# EAGLE design WeatherStation (EAGLE 9.6.2)
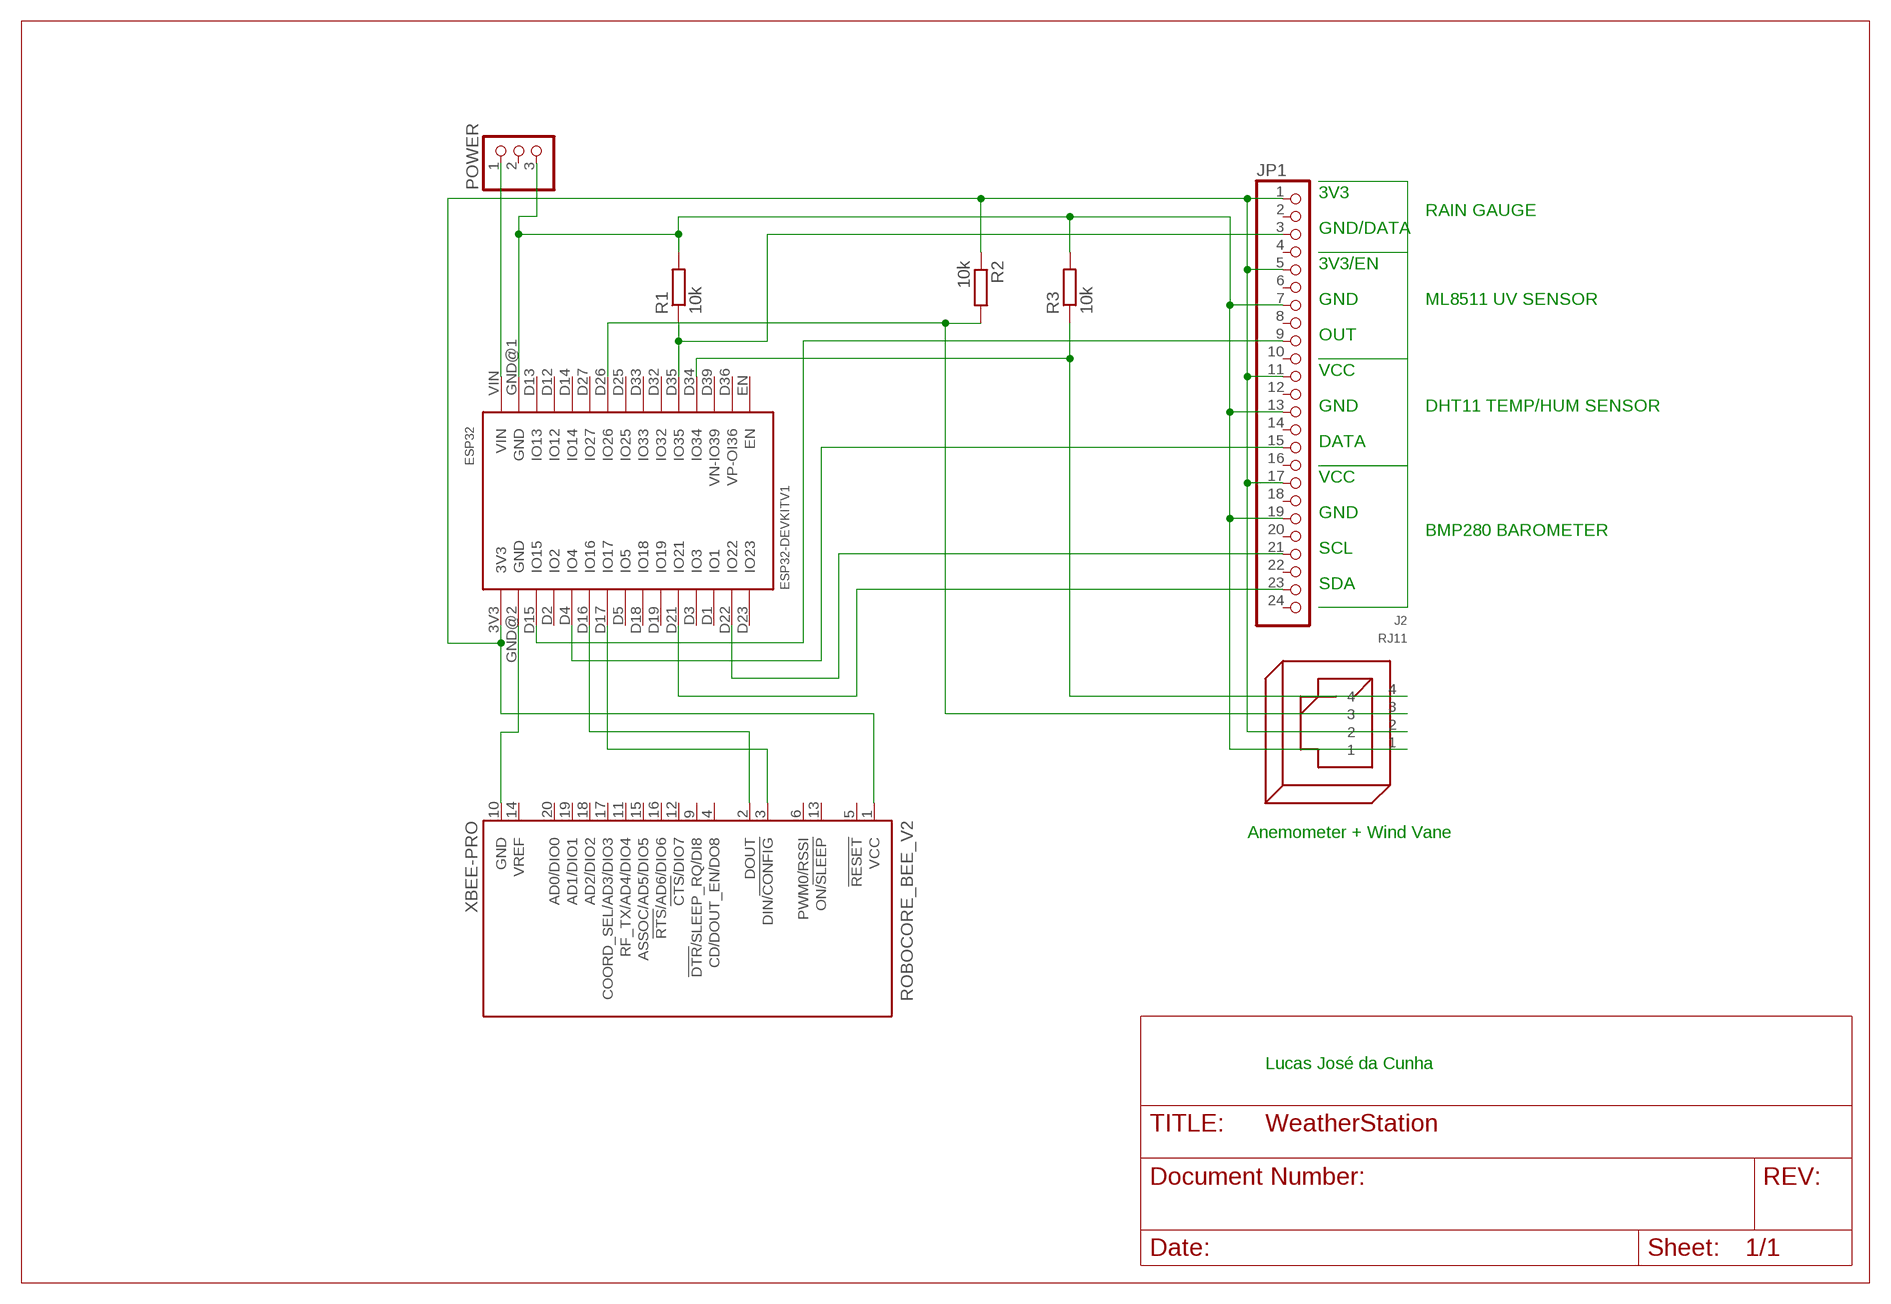
[diagram p0: schematic, sheet 1]

## Parts
ESP32  ESP32DEVKITV1  [ESP32-DEVKITV1]
J2  RJ11  [RJ11]
JP1  PINHD-1X24  [1X24]
POWER  PINHD-1X3  [1X03]
R1  10k  R-EU_0204/7  [0204/7]
R2  10k  R-EU_0204/7  [0204/7]
R3  10k  R-EU_0204/7  [0204/7]
ROBOCORE_BEE_V2  XBEE-PRO  [XBEE-PRO]

## Nets
N$1: ESP32.3V3 J2.2 JP1.1 JP1.5 JP1.11 JP1.17 R2.1 ROBOCORE_BEE_V2.1(VCC)
N$2: ESP32.D26(IO26) J2.3 R2.2
N$3: ESP32.D35(IO35) JP1.3 R1.1
N$4: ESP32.D15(IO15) JP1.9
N$5: ESP32.D16(IO16) ROBOCORE_BEE_V2.2(DOUT)
N$6: ESP32.GND@2(GND) ROBOCORE_BEE_V2.10(GND)
N$7: ESP32.D4(IO4) JP1.15
N$8: ESP32.VIN POWER.1
N$9: ESP32.D22(IO22) JP1.21
N$10: ESP32.D21(IO21) JP1.23
N$11: ESP32.D17(IO17) ROBOCORE_BEE_V2.3(DIN/!CONFIG)
N$13: ESP32.GND@1(GND) J2.1 JP1.7 JP1.13 JP1.19 POWER.3 R1.2 R3.2
N$16: ESP32.D34(IO34) J2.4 R3.1
Unconnected: ESP32.D1(IO1) ESP32.D2(IO2) ESP32.D3(IO3) ESP32.D5(IO5) ESP32.D12(IO12) ESP32.D13(IO13) ESP32.D14(IO14) ESP32.D18(IO18) ESP32.D19(IO19) ESP32.D23(IO23) ESP32.D25(IO25) ESP32.D27(IO27) ESP32.D32(IO32) ESP32.D33(IO33) ESP32.D36(VP-OI36) ESP32.D39(VN-IO39) ESP32.EN JP1.2 JP1.4 JP1.6 JP1.8 JP1.10 JP1.12 JP1.14 JP1.16 JP1.18 JP1.20 JP1.22 JP1.24 POWER.2 ROBOCORE_BEE_V2.4(CD/DOUT_EN/DO8) ROBOCORE_BEE_V2.5(!RESET) ROBOCORE_BEE_V2.6(PWM0/RSSI) ROBOCORE_BEE_V2.9(!DTR!/SLEEP_RQ/DI8) ROBOCORE_BEE_V2.11(RF_TX/AD4/DIO4) ROBOCORE_BEE_V2.12(!CTS!/DIO7) ROBOCORE_BEE_V2.13(ON/!SLEEP) ROBOCORE_BEE_V2.14(VREF) ROBOCORE_BEE_V2.15(ASSOC/AD5/DIO5) ROBOCORE_BEE_V2.16(!RTS!/AD6/DIO6) ROBOCORE_BEE_V2.17(COORD_SEL/AD3/DIO3) ROBOCORE_BEE_V2.18(AD2/DIO2) ROBOCORE_BEE_V2.19(AD1/DIO1) ROBOCORE_BEE_V2.20(AD0/DIO0)

## Notes on the sheet
- 3V3
- RAIN GAUGE
- GND/DATA
- 3V3/EN
- GND | ML8511 UV SENSOR
- OUT
- VCC
- GND | DHT11 TEMP/HUM SENSOR
- DATA
- VCC
- GND
- BMP280 BAROMETER
- SCL
- SDA
- Anemometer + Wind Vane
- Lucas José da Cunha

## Library data of the parts
ESP32 = ESP32-DEVKITV1:ESP32DEVKITV1
J2 = con-rj_fixed:RJ11: RJ11, RJ22 RJ11 and RJ22 jacks side mounted http://www.tycoelectronics.com
JP1 = pinhead:PINHD-1X24: PIN HEADER
POWER = pinhead:PINHD-1X3: PIN HEADER
R1-R3 = rcl:R-EU_: RESISTOR, European symbol; SPICEPREFIX: R
ROBOCORE_BEE_V2 = maxstream:XBEE: XBee (TM) /XBee-PRO(TM) OEM RF Modules Source: MaxStream, Inc. xbee_productmanual.pdf; MPN: XBP24-AWI-001; OC_FARNELL: 1337916; OC_NEWARK: 42M2667

## Board
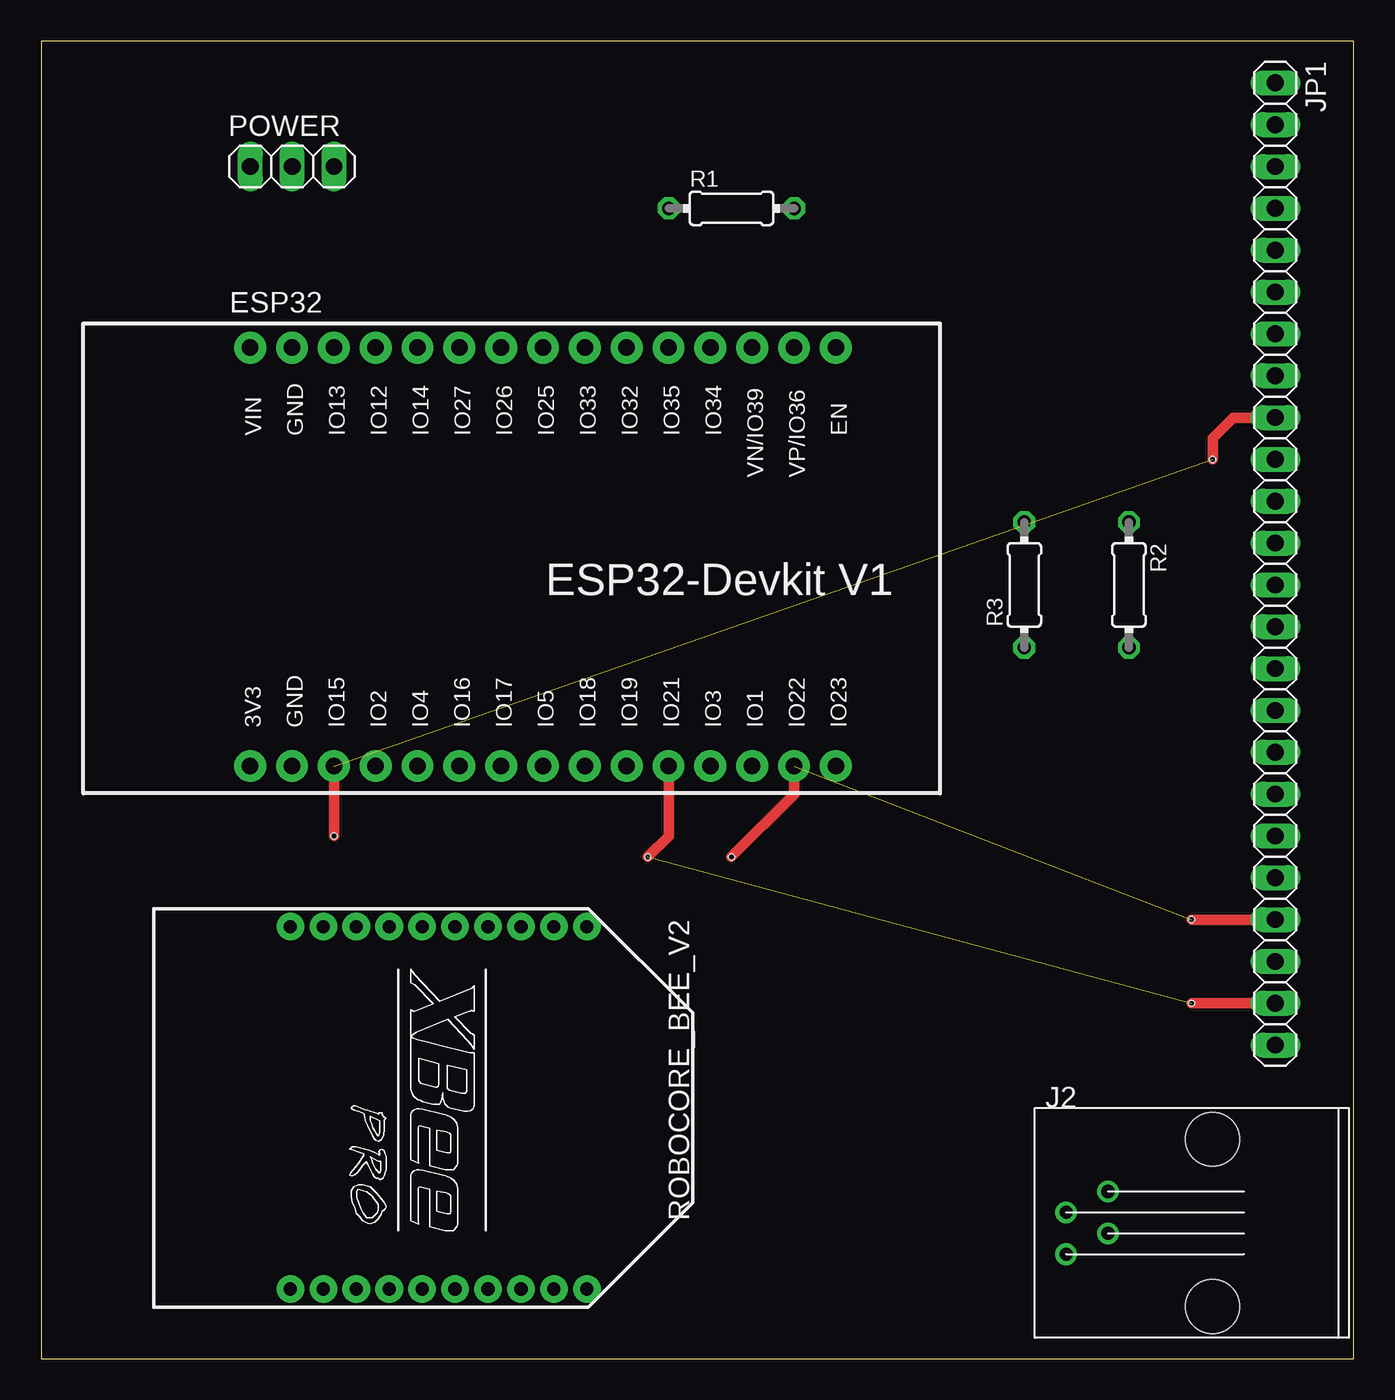
[diagram p1: board, top side]
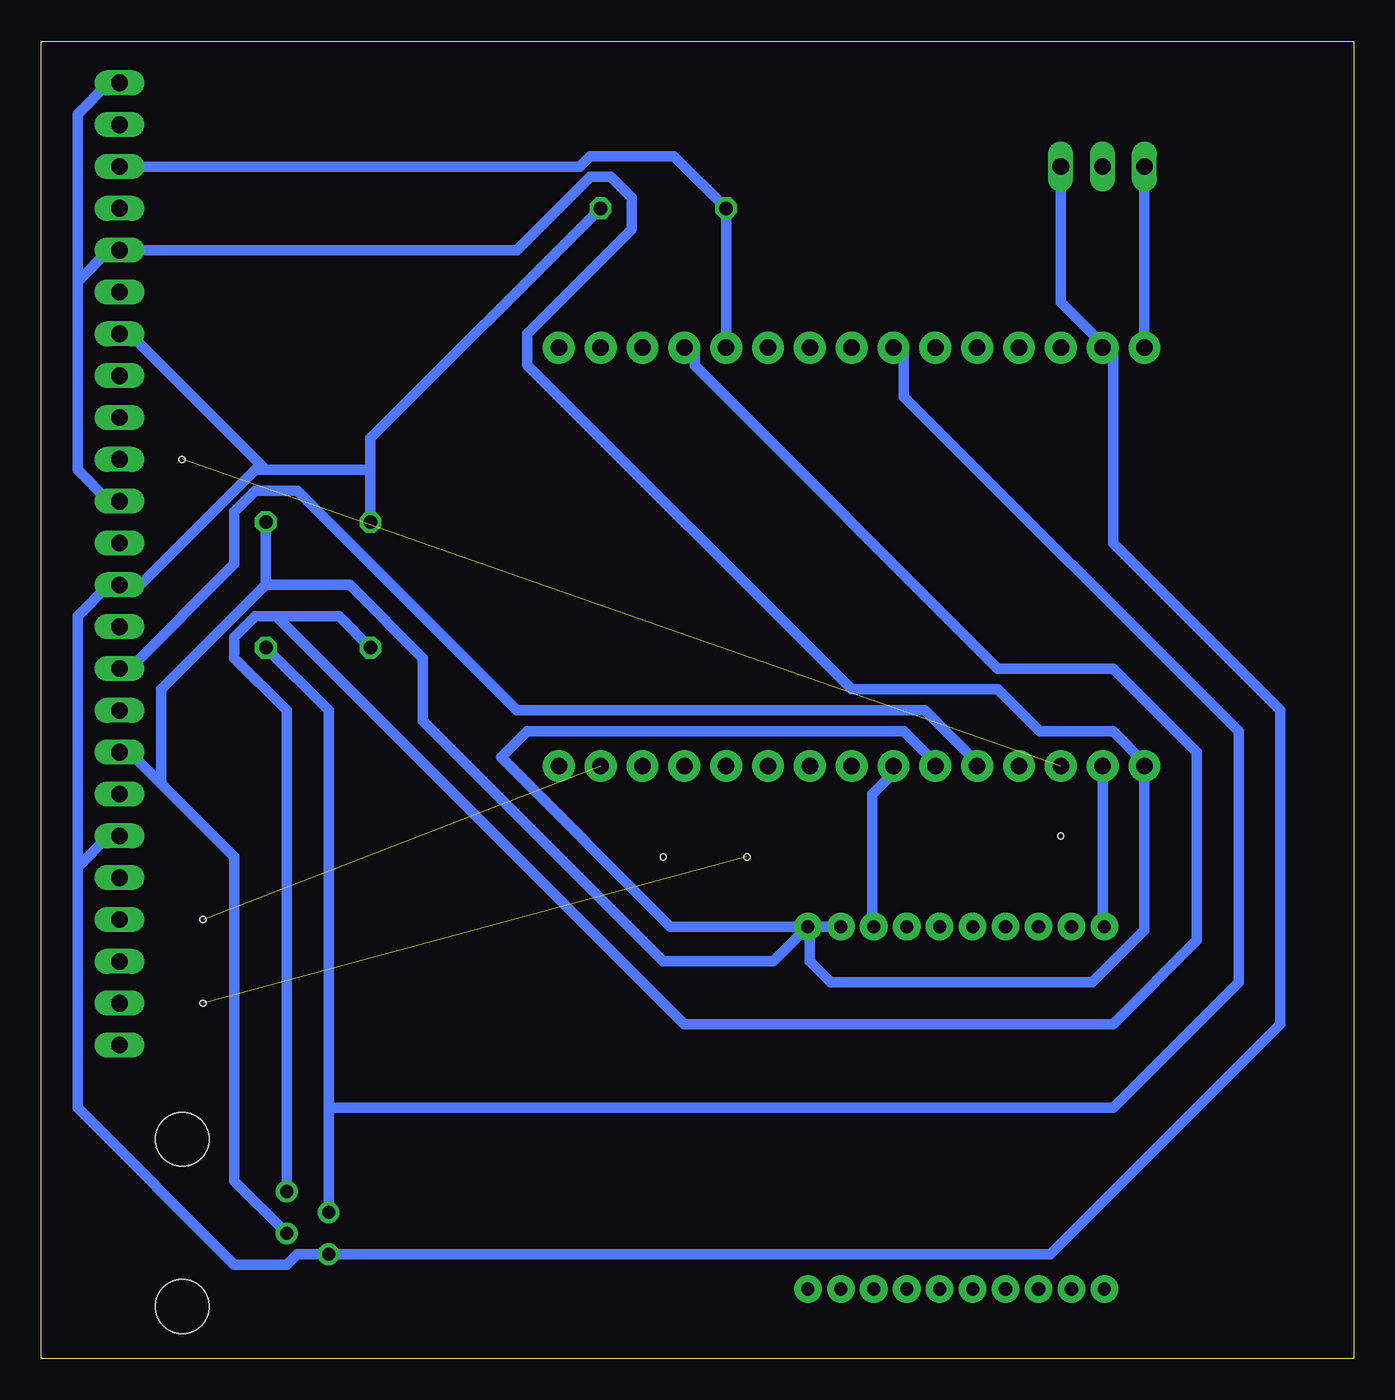
[diagram p2: board, bottom side, seen from below]

Size 79.68 x 80 mm. Coordinates in mm from the lower left corner, seen from the top.
Outline: 0,0 79.68,0 79.68,80 0,80 0,0
Copper layers (1*16): Top 0.035mm / dielectric 1.5mm / Bottom 0.035mm
Design rules "default *": minimum track width 25mil, minimum drill 0.35mm, track to track 10mil, track to pad 15mil, pad to pad 15mil, via to via 15mil, smd to smd 6mil, copper to edge 40mil, drill to drill 6mil, minimum pad ring 10mil, minimum via ring 10mil, stop-mask expansion 4mil, vias tented up to drill 0mil, thermal gap 10mil
Holes 0.35 mm at 17.78,31.75 36.83,30.48 41.91,30.48 69.85,26.67 69.85,21.59 71.12,54.61

### Footprints (pad centres in the part's own frame; a part is rotated, then mirrored left to right if it is on the bottom)
ESP32-DEVKITV1 = drill 1 pad 1.93: 3V3 -16.52,-12.27; D1 13.96,-12.27; D2 -8.9,-12.27; D3 11.42,-12.27; D4 -6.36,-12.27; D5 1.26,-12.27; D12 -8.9,13.135; D13 -11.44,13.135; D14 -6.36,13.135; D15 -11.44,-12.27; D16 -3.82,-12.27; D17 -1.28,-12.27; D18 3.8,-12.27; D19 6.34,-12.27; D21 8.88,-12.27; D22 16.5,-12.27; D23 19.04,-12.27; D25 1.26,13.135; D26 -1.28,13.135; D27 -3.82,13.135; D32 6.34,13.135; D33 3.8,13.135; D34 11.42,13.135; D35 8.88,13.135; D36 16.5,13.135; D39 13.96,13.135; EN 19.04,13.135; GND@1 -13.98,13.135; GND@2 -13.98,-12.27; VIN -16.52,13.135
RJ11 = drill 0.8: 1 -6.35,-2.54; 2 -3.81,-1.27; 3 -6.35,0; 4 -3.81,1.27 | hole 3.25: 2.54,-5.715; 2.54,4.445
1X24 = drill 1.016 long: 1 -29.21,0; 2 -26.67,0; 3 -24.13,0; 4 -21.59,0; 5 -19.05,0; 6 -16.51,0; 7 -13.97,0; 8 -11.43,0; 9 -8.89,0; 10 -6.35,0; 11 -3.81,0; 12 -1.27,0; 13 1.27,0; 14 3.81,0; 15 6.35,0; 16 8.89,0; 17 11.43,0; 18 13.97,0; 19 16.51,0; 20 19.05,0; 21 21.59,0; 22 24.13,0; 23 26.67,0; 24 29.21,0
1X03 = drill 1.016 long: 1 -2.54,0; 2 0,0; 3 2.54,0
0204/7 = drill 0.813 octagon: 1 -3.81,0; 2 3.81,0
XBEE-PRO = drill 0.8 pad 1.676: 1 -11,9; 2 -11,7; 3 -11,5; 4 -11,3; 5 -11,1; 6 -11,-1; 7 -11,-3; 8 -11,-5; 9 -11,-7; 10 -11,-9; 11 11,-9; 12 11,-7; 13 11,-5; 14 11,-3; 15 11,-1; 16 11,1; 17 11,3; 18 11,5; 19 11,7; 20 11,9

### Placement (x,y rotation side)
ESP32  29.21,48.26 0 top
J2  68.58,8.89 0 top
JP1  74.93,48.26 270 top
POWER  15.24,72.39 0 top
R1  41.91,69.85 0 top
R2  66.04,46.99 270 top
R3  59.69,46.99 90 top
ROBOCORE_BEE_V2  24.13,15.24 270 top

### Tracks (layer width: path | path; a pad name or v marks a point on that pad's centre or on a via)
N$1
  Bottom 0.635: J2.2 67.94,10.79 67.94,30.48 72.39,34.92 | 72.39,34.92 74.3,36.83 JP1.17 | 66.04,46.99 R2.1 | 66.04,46.99 72.39,40.64 72.39,34.92 | JP1.11 75.56,52.07 77.47,53.98 77.47,65.41 | 77.47,65.41 75.56,67.31 JP1.5 50.8,67.31 46.35,71.75 45.09,71.75 43.81,70.48 43.81,68.58 50.16,62.23 50.16,60.33 30.48,40.64 21.59,40.64 19.05,38.1 14.61,38.1 12.7,36.2 ESP32.3V3 12.7,35.56 12.7,26.04 15.88,22.86 31.75,22.86 33.02,24.13 33.02,26.04 ROBOCORE_BEE_V2.1 35.24,24.13 41.91,24.13 56.52,38.73 56.52,42.55 60.96,46.99 66.04,46.99 | JP1.1 75.56,77.47 77.47,75.56 77.47,65.41
N$2
  Bottom 0.635: 62.23,15.24 62.23,39.37 R2.2 | 62.23,15.24 J2.3 | 62.23,15.24 14.61,15.24 6.99,22.86 6.99,38.1 27.3,58.42 27.3,60.96 ESP32.D26
N$3
  Bottom 0.635: ESP32.D35 38.1,61.59 R1.1 41.27,73.03 46.35,73.03 46.99,72.39 JP1.3
N$4  (1 unrouted)
  Top 0.635: ESP32.D15 17.78,31.75 | JP1.9 72.39,57.15 71.12,55.88 71.12,54.61
N$5
  Bottom 0.635: ROBOCORE_BEE_V2.2 41.48,26.24 51.75,36.51 50.16,38.1 27.3,38.1 25.4,36.2 ESP32.D16
N$6
  Bottom 0.635: ROBOCORE_BEE_V2.10 15.24,26.67 15.24,35.56 ESP32.GND@2
N$7
  Bottom 0.635: JP1.15 74.3,41.91 67.94,48.26 67.94,51.44 66.67,52.7 64.14,52.7 50.8,39.37 26.04,39.37 22.86,36.2 ESP32.D4
N$8
  Bottom 0.635: POWER.1 12.7,61.59 ESP32.VIN
N$9  (1 unrouted)
  Top 0.635: ESP32.D22 45.71,34.28 41.91,30.48 | JP1.21 69.85,26.67
N$10  (1 unrouted)
  Top 0.635: ESP32.D21 38.09,31.74 36.83,30.48 | JP1.23 69.85,21.59
N$11
  Bottom 0.635: ROBOCORE_BEE_V2.3 29.21,26.67 29.21,34.29 27.94,35.56 ESP32.D17
N$13
  Bottom 0.635: 59.69,53.98 59.69,55.88 R1.2 | 59.69,53.98 R3.2 | 59.69,53.98 66.04,53.98 | 66.04,53.98 66.67,53.98 73.66,46.99 JP1.13 75.56,46.99 77.47,45.09 77.47,29.84 | JP1.7 74.3,62.23 66.04,53.98 | POWER.3 17.78,64.14 15.24,61.59 ESP32.GND@1 14.61,60.96 14.61,49.53 4.45,39.37 4.45,20.32 18.41,6.35 J2.1 64.14,6.35 64.77,5.71 67.94,5.71 77.47,15.24 77.47,29.84 | 77.47,29.84 75.56,31.75 JP1.19
N$16
  Bottom 0.635: J2.4 64.77,39.37 67.94,42.55 67.94,43.81 66.67,45.09 65.41,45.09 | 65.41,45.09 61.59,45.09 R3.1 | 65.41,45.09 40.64,20.32 14.61,20.32 9.53,25.4 9.53,36.83 14.61,41.91 21.59,41.91 40.01,60.33 40.01,60.96 ESP32.D34